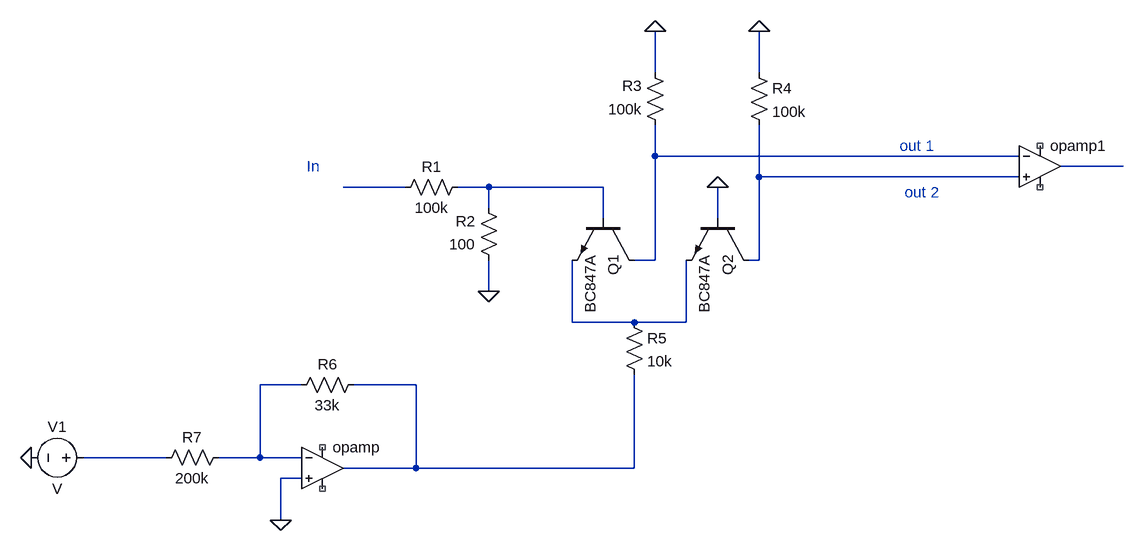
[diagram p0: schematic jfet voltage controlled amplifier.asc]
jfet voltage controlled amplifier.asc, the LTspice schematic file:
Version 4
SHEET 1 880 680
WIRE -16 -240 -16 -304
WIRE 144 -240 144 -304
WIRE -16 -112 -16 -160
WIRE 544 -112 -16 -112
WIRE 704 -96 608 -96
WIRE 144 -80 144 -160
WIRE 544 -80 144 -80
WIRE -400 -64 -496 -64
WIRE -272 -64 -320 -64
WIRE -96 -64 -272 -64
WIRE -272 -32 -272 -64
WIRE -96 -16 -96 -64
WIRE 80 -16 80 -64
WIRE -16 48 -16 -112
WIRE -16 48 -48 48
WIRE 144 48 144 -80
WIRE 144 48 128 48
WIRE -272 96 -272 48
WIRE -144 144 -144 48
WIRE -48 144 -144 144
WIRE 32 144 32 48
WIRE 32 144 -48 144
WIRE -560 240 -624 240
WIRE -384 240 -480 240
WIRE -768 352 -896 352
WIRE -624 352 -624 240
WIRE -624 352 -688 352
WIRE -560 352 -624 352
WIRE -384 368 -384 240
WIRE -384 368 -496 368
WIRE -48 368 -48 224
WIRE -48 368 -384 368
WIRE -560 384 -592 384
WIRE -592 448 -592 384
FLAG 80 -64 0
FLAG -272 96 0
FLAG -592 448 0
FLAG -16 -304 0
FLAG 144 -304 0
FLAG -976 352 0
SYMBOL npn -48 -16 R90
SYMATTR InstName Q1
SYMATTR Value BC847A
SYMBOL npn 128 -16 R90
SYMATTR InstName Q2
SYMATTR Value BC847A
SYMBOL res -304 -80 R90
WINDOW 0 0 56 VBottom 2
WINDOW 3 32 56 VTop 2
SYMATTR InstName R1
SYMATTR Value 100k
SYMBOL res -256 64 R180
WINDOW 0 36 76 Left 2
WINDOW 3 36 40 Left 2
SYMATTR InstName R2
SYMATTR Value 100
SYMBOL res 0 -144 R180
WINDOW 0 36 76 Left 2
WINDOW 3 36 40 Left 2
SYMATTR InstName R3
SYMATTR Value 100k
SYMBOL res 128 -256 R0
SYMATTR InstName R4
SYMATTR Value 100k
SYMBOL res -64 128 R0
SYMATTR InstName R5
SYMATTR Value 10k
SYMBOL res -464 224 R90
WINDOW 0 0 56 VBottom 2
WINDOW 3 32 56 VTop 2
SYMATTR InstName R6
SYMATTR Value 33k
SYMBOL res -672 336 R90
WINDOW 0 0 56 VBottom 2
WINDOW 3 32 56 VTop 2
SYMATTR InstName R7
SYMATTR Value 200k
SYMBOL voltage -880 352 R90
WINDOW 0 -32 56 VBottom 2
WINDOW 3 32 56 VTop 2
SYMATTR InstName V1
SYMBOL OpAmps\\UniversalOpAmp1 -528 368 R0
SYMATTR InstName opamp
SYMBOL OpAmps\\UniversalOpAmp1 576 -96 R0
SYMATTR InstName opamp1
TEXT 360 -128 Left 2 ;out 1
TEXT 368 -56 Left 2 ;out 2
TEXT -552 -96 Left 2 ;In

The netlist it stands for:
* jfet voltage controlled amplifier.asc
Q1 N001 N005 N006 0 BC847A
Q2 N003 0 N006 0 BC847A
R1 N005 N004 100k
R2 0 N005 100
R3 N001 0 100k
R4 0 N003 100k
R5 N006 N008 10k
R6 N008 N007 33k
R7 N007 N009 200k
V1 N009 0 V
Xopamp 0 N007 NC_01 NC_02 N008 level1 Avol=1Meg GBW=10Meg Vos=0 En=0 Enk=0 In=0 Ink=0 Rin=500Meg  ; pins In+ In- V+ V- OUT
Xopamp1 N003 N001 NC_03 NC_04 N002 level1 Avol=1Meg GBW=10Meg Vos=0 En=0 Enk=0 In=0 Ink=0 Rin=500Meg  ; pins In+ In- V+ V- OUT
.model NPN NPN
.model PNP PNP
.lib standard.bjt
* out 1
* out 2
* In
.lib UniversalOpAmp1.lib
.backanno
.end